# Altium schematic sheet Power.SchDoc: =ProjectName
size A4; CheckedBy: DatNB; Author: Ven; CompanyName: Nacentech; Organization: IMET
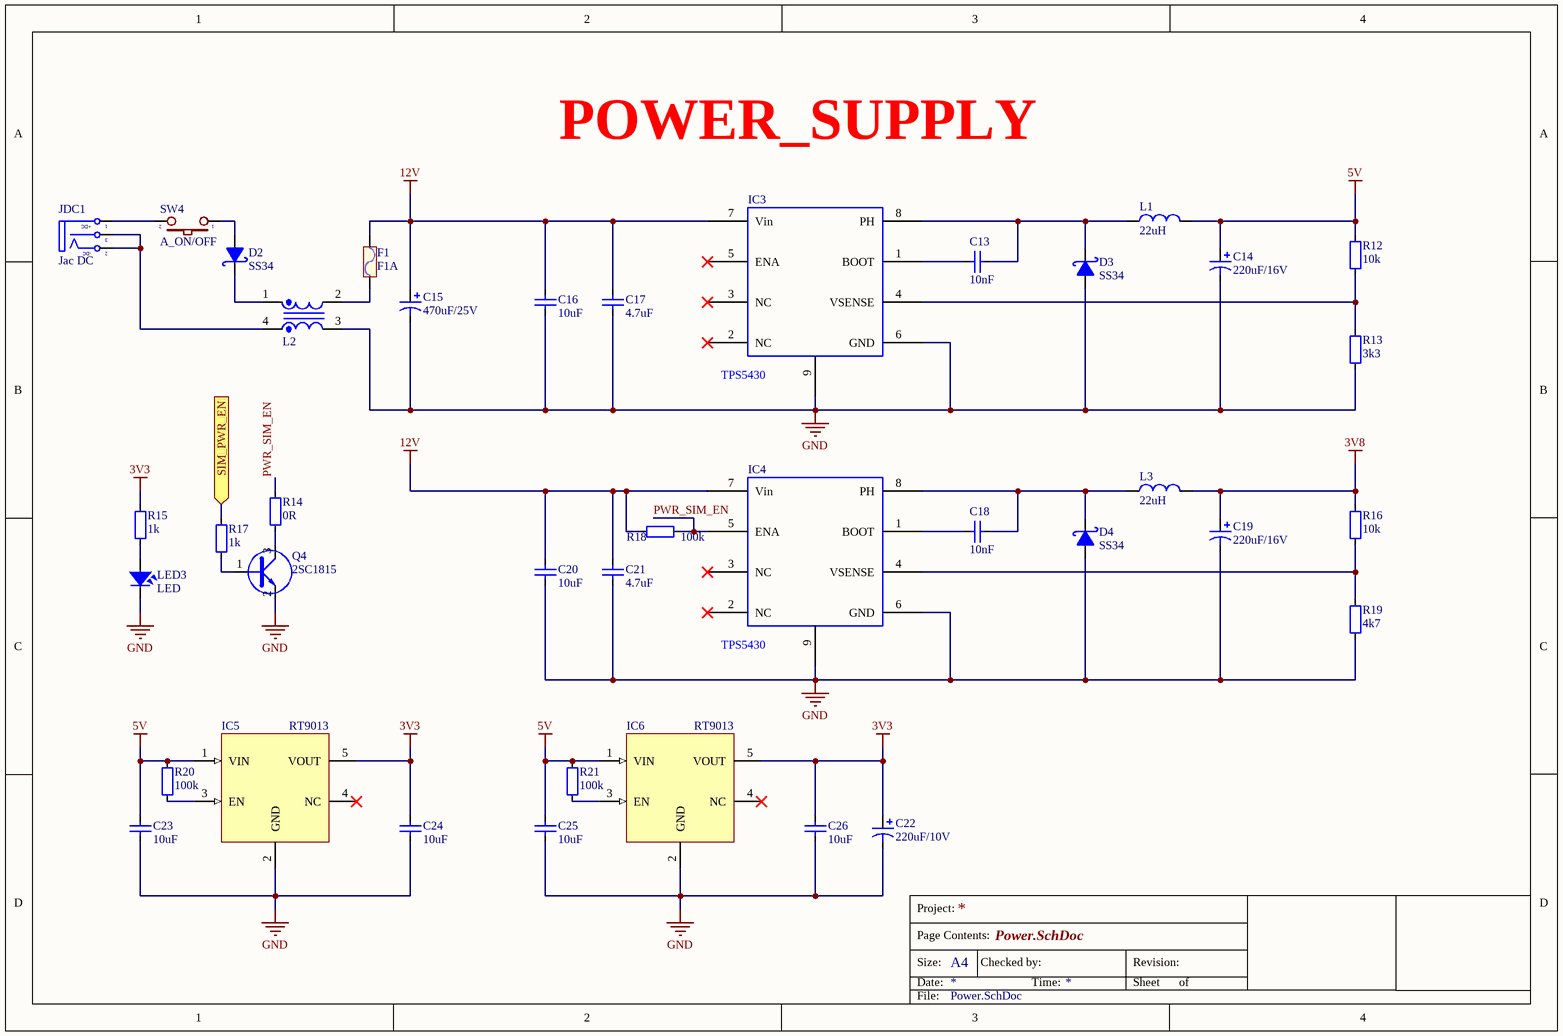
[diagram p0: Power.SchDoc]

## Parts
C13  10nF  [CAP_0805]
C14  220uF/16V  [C8mm]
C15  470uF/25V  [C8mm]
C16  10uF  [CAP_0805]
C17  4.7uF  [CAP_0805]
C18  10nF  [CAP_0805]
C19  220uF/16V  [C8mm]
C20  10uF  [CAP_0805]
C21  4.7uF  [CAP_0805]
C22  220uF/10V  [C8mm]
C23  10uF  [CAP_0805]
C24  10uF  [CAP_0805]
C25  10uF  [CAP_0805]
C26  10uF  [CAP_0805]
D2  SS34  [DO-214AC(SMA)]
D3  SS34  [DO-214AC(SMA)]
D4  SS34  [DO-214AC(SMA)]
F1  F1A  [FUSE2C]
IC3  TPS5430  [TPS5430-2]
IC4  TPS5430  [TPS5430-2]
IC5  RT9013  [SOT23-5]
IC6  RT9013  [SOT23-5]
JDC1  Jac DC  [DC-IN]
L1  22uH  [L-SMD-M-7.3x4.5]
L2  Inductor Filter  [EE8.3]  (value not drawn)
L3  22uH  [L-SMD-M-7.3x4.5]
LED3  LED  [LED-0805-Red]
Q4  2SC1815  [SOT23D]
R12  10k  [RES-SMD-0805]
R13  3k3  [RES-SMD-0805]
R14  0R  [RES-SMD-0805]
R15  1k  [RES-SMD-0805]
R16  10k  [RES-SMD-0805]
R17  1k  [RES-SMD-0805]
R18  100k  [RES-SMD-0805]
R19  4k7  [RES-SMD-0805]
R20  100k  [RES-SMD-0805]
R21  100k  [RES-SMD-0805]
SW4  A_ON/OFF  [SW102_SIDE]

## Ports
SIM_PWR_EN (in)

## Nets
3V3: C22.1 C24.2 C26.2 IC5.5(VOUT) IC6.5(VOUT) R15.2
3V8: C19.1 L3.2 R16.2
5V: C14.1 C23.2 C25.2 IC5.1(VIN) IC6.1(VIN) L1.2 R12.2 R20.1 R21.1
12V: C15.1 C16.2 C17.2 C20.2 C21.2 F1.2 IC3.7(Vin) IC4.7(Vin) R18.2
GND: C14.2 C15.2 C16.1 C17.1 C19.2 C20.1 C21.1 C22.2 C23.1 C24.1 C25.1 C26.1 D3.1(A) D4.1(A) IC3.6(GND) IC3.9(PWR_PAD) IC4.6(GND) IC4.9(PWR_PAD) IC5.2(GND) IC6.2(GND) L2.3 LED3.2 Q4.2(E) R13.1 R19.1
PWR_SIM_EN: IC4.5(ENA) R14.2 R18.1
SIM_PWR_EN: R17.2 ; port SIM_PWR_EN
NetC13_1: C13.1 D3.2(K) IC3.8(PH) L1.1
NetC13_2: C13.2 IC3.1(BOOT)
NetC18_1: C18.1 D4.2(K) IC4.8(PH) L3.1
NetC18_2: C18.2 IC4.1(BOOT)
NetD2_1: D2.1(A) SW4.1
NetD2_2: D2.2(K) L2.1
NetF1_1: F1.1 L2.2
NetIC3_4: IC3.4(VSENSE) R12.1 R13.2
NetIC4_4: IC4.4(VSENSE) R16.1 R19.2
NetIC5_3: IC5.3(EN) R20.2
NetIC6_3: IC6.3(EN) R21.2
NetJDC1_1: JDC1.1(T) SW4.2
NetJDC1_2: JDC1.2(TN) JDC1.3(S) L2.4
NetLED3_1: LED3.1 R15.1
NetQ4_1: Q4.1(B) R17.1
NetQ4_3: Q4.3(C) R14.1

Not connected (* = marked no-connect by the designer): IC3 2(NC)* 3(NC)* 5(ENA)*; IC4 2(NC)* 3(NC)*; IC5 4(NC)*; IC6 4(NC)*

## Notes on the sheet
- POWER_SUPPLY
- Project:
- Page Contents:
- Size:
- Date:
- A4
- Checked by:
- Time:
- Revision:
- Sheet
- of
- File:
- (in symbol DCIN) +DC; -DC

## Library data of the parts
C13 C16-C18 C20 C21 C23-C26 = CapSMD: Capacitor; Value: 33p; Published: 8-Jun-2000; LatestRevisionDate: 17-Jul-2002; LatestRevisionNote: Re-released for DXP Platform.; PackageReference: RAD-0.3; Publisher: Altium Limited
C14 C15 C19 C22 = Cap Pol: Polarized Capacitor (Axial); Published: 8-Jun-2000; LatestRevisionDate: 17-Jul-2002; LatestRevisionNote: Re-released for DXP Platform.; PackageReference: POLAR0.8; Publisher: Altium Limited
D2-D4 = Diode Schottky: Diode Schottky SS34
F1 = Fuse: Fuse RUEF300 30V 3A; Designed by: VanDungEvn; Value: Fuse
IC5 IC6 = RT9013: RT9013-33GB IC REG LINEAR 3.3V 500mA SOT23-5
JDC1 = DCIN: Jac DC input; Value: Jac DC
L1 L3 = Inductor: Value: 150 mH
L2 = L_Filter: Value: Loc 220; Designed by: VanDungEvn
LED3 = LED: LED Single colour Green and Red; Value: LED 3 ly Single Colour
Q4 = C1815: NPN 600mW, ECB; Value: C1815
R12-R21 = Resistor - SMD: Resistor; Manufacturer: Generic Components; Class: Passive; Published: 08/06/2000; Publisher: Altium Hobart Technology Centre
SW4 = SW2: Switch button 2 pin; Value: SW chip 2 pin
IC3 IC4 = TPS5430: Name: TPS5430